# Altium schematic sheet MC14490P_module_PCB.SchDoc: MC14490P module
size A4; Author: Andrea Mancini; DocumentNumber: 1; Revision: 1; SheetNumber: 3; SheetTotal: 3; FileName: MC14490P_module_PCB.SchDoc; DescriptionLine1: module for I/O; DescriptionLine2: signal debounce; DescriptionLine3: using the MC14490P
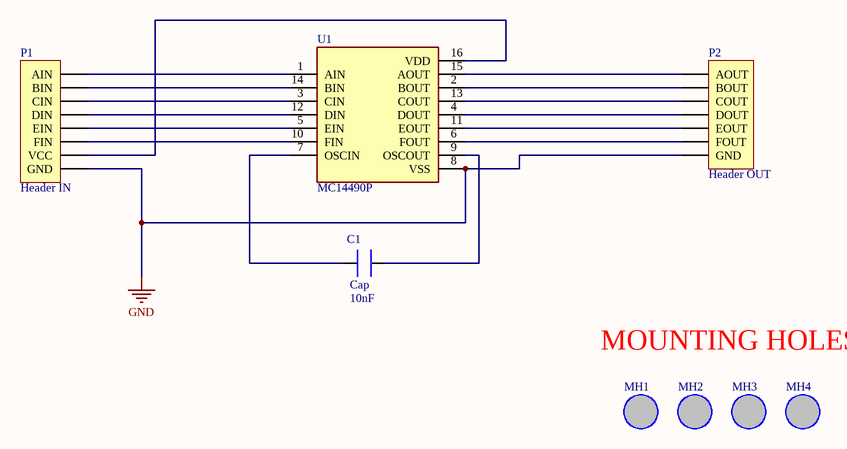
[diagram p0: MC14490P_module_PCB.SchDoc]

## Parts
C1  Cap  value 10nF  [RAD-0.3]
MH1  Mounting Hole 3.2mm Drill  [MH_3.2MMD]  (value not drawn)  (no BOM)
MH2  Mounting Hole 3.2mm Drill  [MH_3.2MMD]  (value not drawn)  (no BOM)
MH3  Mounting Hole 3.2mm Drill  [MH_3.2MMD]  (value not drawn)  (no BOM)
MH4  Mounting Hole 3.2mm Drill  [MH_3.2MMD]  (value not drawn)  (no BOM)
P1  Header IN  [HDR1X8]
P2  Header OUT  [HDR1X7]
U1  MC14490P  [DIP762W46P254L1918H444Q16P]

## Nets
GND: P1.1(GND) P2.1(GND) U1.8(VSS)
NetC1_1: C1.1 U1.7(OSCIN)
NetC1_2: C1.2 U1.9(OSCOUT)
NetP1_2: P1.2(VCC) U1.16(VDD)
NetP1_3: P1.3(FIN) U1.10(FIN)
NetP1_4: P1.4(EIN) U1.5(EIN)
NetP1_5: P1.5(DIN) U1.12(DIN)
NetP1_6: P1.6(CIN) U1.3(CIN)
NetP1_7: P1.7(BIN) U1.14(BIN)
NetP1_8: P1.8(AIN) U1.1(AIN)
NetP2_2: P2.2(FOUT) U1.6(FOUT)
NetP2_3: P2.3(EOUT) U1.11(EOUT)
NetP2_4: P2.4(DOUT) U1.4(DOUT)
NetP2_5: P2.5(COUT) U1.13(COUT)
NetP2_6: P2.6(BOUT) U1.2(BOUT)
NetP2_7: P2.7(AOUT) U1.15(AOUT)

## Notes on the sheet
- MOUNTING HOLES
- Title
- Size:
- Date:
- A4
- Number:
- Time:
- Revision:
- Sheet
- of
- Author:
- File:

## Library data of the parts
C1 = Cap: Capacitor; Published: 8-Jun-2000; LatestRevisionDate: 17-Jul-2002; LatestRevisionNote: Re-released for DXP Platform.; PackageReference: RAD-0.3; Publisher: Altium Limited; PackageDescription: Radial Cap, Thru-Hole; 2 Leads; 0.3 in Pin Spacing
MH1-MH4 = MH_3.2MMD
P1 = Header8_Debounce: Header, 8-Pin debounce input; LatestRevisionDate: 17-Jul-2002; LatestRevisionNote: Re-released for DXP Platform.; Publisher: Altium Limited
P2 = Header_7_Debounce: Header, 7-Pin debounce output; LatestRevisionDate: 17-Jul-2002; LatestRevisionNote: Re-released for DXP Platform.; Publisher: Altium Limited
U1 = MC14490P: Contact Bounce Eliminator IC 16-DIP; MF: ON Semiconductor; Value: *; Availability: Unavailable; Package: DIP-16 ON Semiconductor; Price: None; SnapEDA_Link: https://www.snapeda.com/parts/MC14490P/ON%20Semiconductor/view-part/4220489/?ref=snap; MP: MC14490P